# Altium schematic sheet Sheet2.SchDoc
size A3; SheetNumber: 1; SheetTotal: 1
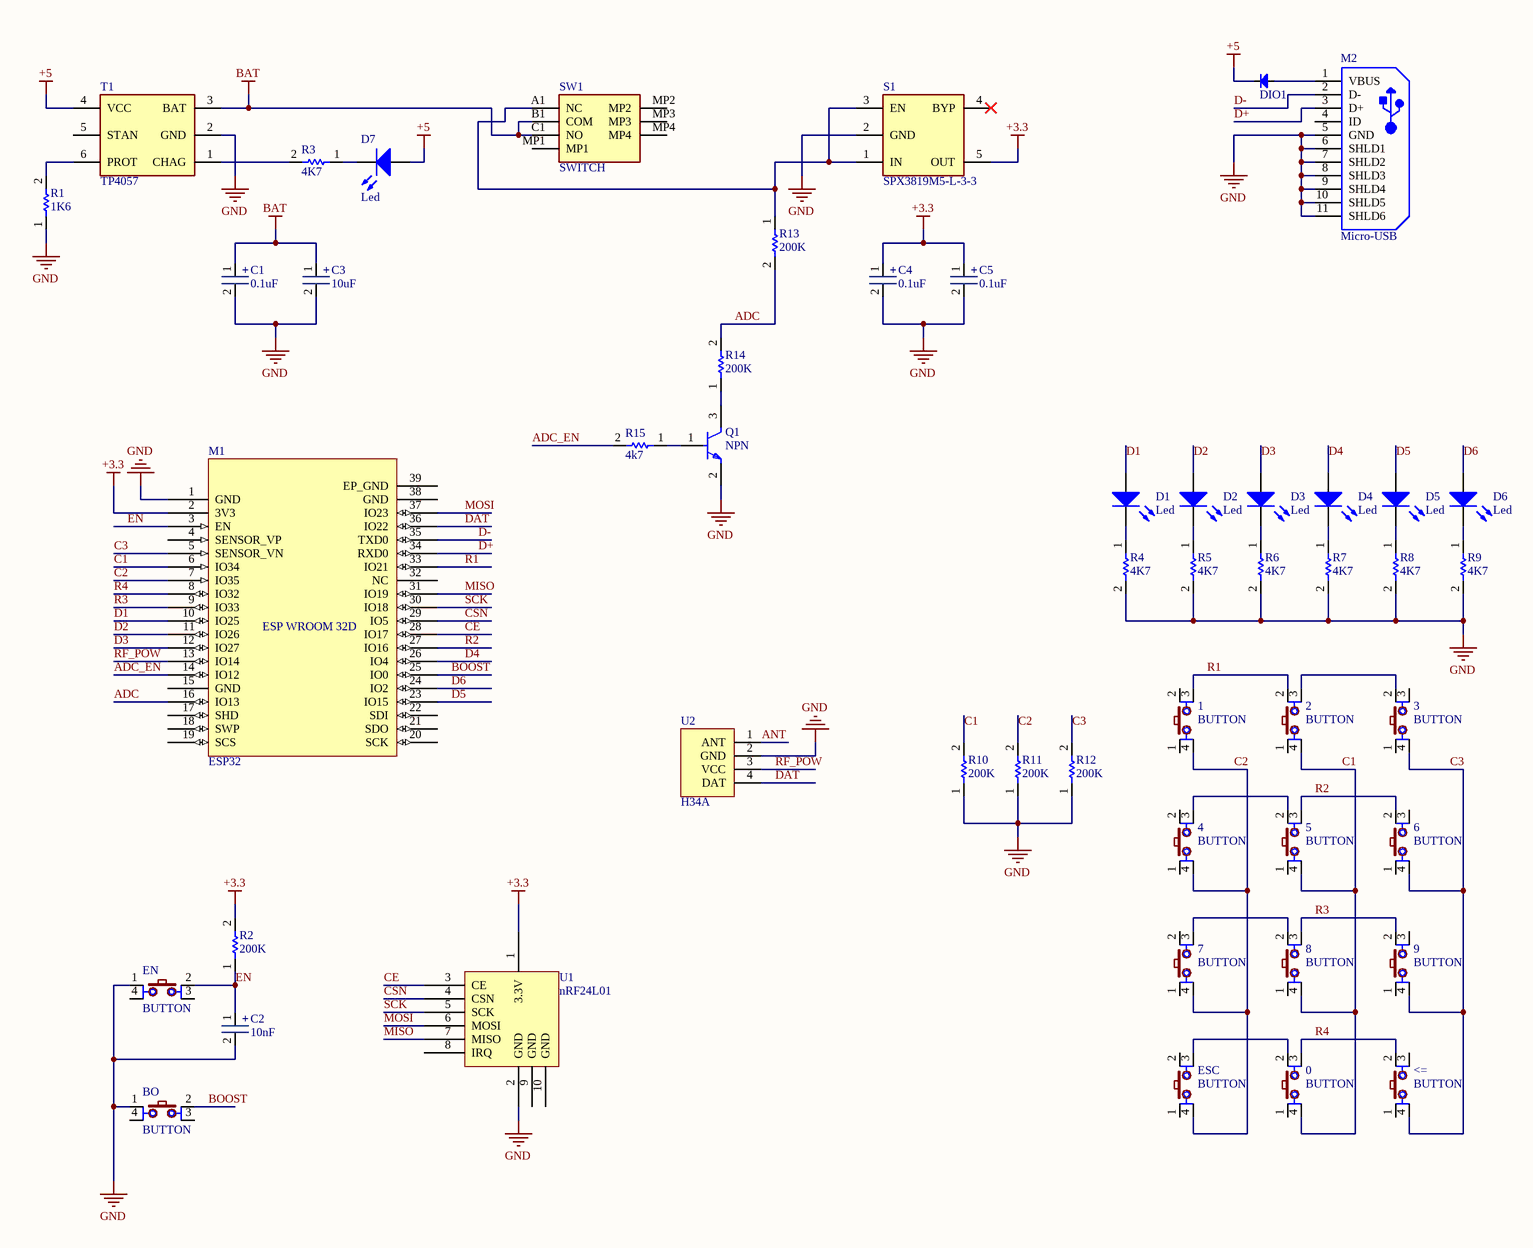
[diagram p0: Sheet2.SchDoc]

## Parts
0  BUTTON  [BUTTON 4X4mm]
1  BUTTON  [BUTTON 4X4mm]
2  BUTTON  [BUTTON 4X4mm]
3  BUTTON  [BUTTON 4X4mm]
4  BUTTON  [BUTTON 4X4mm]
5  BUTTON  [BUTTON 4X4mm]
6  BUTTON  [BUTTON 4X4mm]
7  BUTTON  [BUTTON 4X4mm]
8  BUTTON  [BUTTON 4X4mm]
9  BUTTON  [BUTTON 4X4mm]
<=  BUTTON  [BUTTON 4X4mm]
BO  BUTTON  [BUTTON 3x4mm 4PIN]
C1  0.1uF  [Cap_0603_A]
C2  10nF  [Cap_0603_A]
C3  10uF  [Cap_0603_A]
C4  0.1uF  [Cap_0603_A]
C5  0.1uF  [Cap_0603_A]
D1  Led  [LED 0603]
D2  Led  [LED 0603]
D3  Led  [LED 0603]
D4  Led  [LED 0603]
D5  Led  [LED 0603]
D6  Led  [LED 0603]
D7  Led  [LED 0603]
DIO1  Diode SMD  [DIO-SMD-123]  (value not drawn)
EN  BUTTON  [BUTTON 3x4mm 4PIN]
ESC  BUTTON  [BUTTON 4X4mm]
M1  ESP32  [ESP32-WROOM-32D]
M2  Micro-USB  [2.0 5 PIN SMD]
Q1  NPN  [FP-SOT23-IPC_C]
R1  1K6  [Res_0603]
R2  200K  [Res_0603]
R3  4K7  [Res_0603]
R4  4K7  [Res_0603]
R5  4K7  [Res_0603]
R6  4K7  [Res_0603]
R7  4K7  [Res_0603]
R8  4K7  [Res_0603]
R9  4K7  [Res_0603]
R10  200K  [Res_0603]
R11  200K  [Res_0603]
R12  200K  [Res_0603]
R13  200K  [Res_0603]
R14  200K  [Res_0603]
R15  4k7  [Res_0603]
S1  SPX3819M5-L-3-3  [FP-C04-091-OT-IPC_A]
SW1  SWITCH  [MSK12C02]
T1  TP4057  [TP4057]
U1  nRF24L01  [NRF24L01 + PA SMD]
U2  H34A  [H34A]

## Nets
+3.3: C4.1 C5.1 M1.2(3V3) R2.2 S1.5(OUT) U1.1(3.3V)
+5: D7.1(A) DIO1.2(K) T1.4(VCC)
BAT: C1.1 C3.1 SW1.B1(COM) SW1.C1(NO) T1.3(BAT)
GND: BO.1 C1.2 C2.2 C3.2 C4.2 C5.2 EN.1 M1.1(GND) M2.5(GND) M2.6(SHLD1) M2.7(SHLD2) M2.8(SHLD3) M2.9(SHLD4) M2.10(SHLD5) M2.11(SHLD6) Q1.2(E) R1.1 R4.2 R5.2 R6.2 R7.2 R8.2 R9.2 R10.1 R11.1 R12.1 S1.2(GND) T1.2(GND) U1.2(GND) U2.2(GND)
ADC: M1.16(IO13) R13.2 R14.2
ADC_EN: M1.14(IO12) R15.2
ANT: U2.1(ANT)
BOOST: BO.2 M1.25(IO0)
C1: 0.4 2.4 5.4 8.4 M1.6(IO34) R10.2
C2: 1.4 4.4 7.4 ESC.4 M1.7(IO35) R11.2
C3: 3.4 6.4 9.4 <=.4 M1.5(SENSOR_VN) R12.2
CE: M1.28(IO17) U1.3(CE)
CSN: M1.29(IO5) U1.4(CSN)
D1: D1.1(A) M1.10(IO25)
D2: D2.1(A) M1.11(IO26)
D3: D3.1(A) M1.12(IO27)
D4: D4.1(A) M1.26(IO4)
D5: D5.1(A) M1.23(IO15)
D6: D6.1(A) M1.24(IO2)
D+: M1.34(RXD0) M2.3(D+)
D-: M1.35(TXD0) M2.2(D-)
DAT: M1.36(IO22) U2.4(DAT)
EN: C2.1 EN.2 M1.3(EN) R2.1
MISO: M1.31(IO19) U1.7(MISO)
MOSI: M1.37(IO23) U1.6(MOSI)
R1: 1.3 2.2 M1.33(IO21)
R2: 5.3 6.2 M1.27(IO16)
R3: 8.3 9.2 M1.9(IO33)
R4: 0.3 <=.2 M1.8(IO32)
RF_POW: M1.13(IO14) U2.3(VCC)
SCK: M1.30(IO18) U1.5(SCK)
Net0_2: 0.2 ESC.3
Net2_3: 2.3 3.2
Net4_3: 4.3 5.2
Net7_3: 7.3 8.2
NetD1_2: D1.2(K) R4.1
NetD2_2: D2.2(K) R5.1
NetD3_2: D3.2(K) R6.1
NetD4_2: D4.2(K) R7.1
NetD5_2: D5.2(K) R8.1
NetD6_2: D6.2(K) R9.1
NetD7_2: D7.2(K) R3.1
NetDIO1_1: DIO1.1(A) M2.1(VBUS)
NetQ1_1: Q1.1(B) R15.1
NetQ1_3: Q1.3(C) R14.1
NetR1_2: R1.2 T1.6(PROT)
NetR3_2: R3.2 T1.1(CHAG)
NetR13_1: R13.1 S1.1(IN) S1.3(EN) SW1.A1(NC)

Not connected (* = marked no-connect by the designer): 0 1; 1 1 2; 2 1; 3 1 3; 4 1 2; 5 1; 6 1 3; 7 1 2; 8 1; 9 1 3; <= 1 3; BO 3 4; EN 3 4; ESC 1 2; M1 4(SENSOR_VP) 15(GND) 17(SHD) 18(SWP) 19(SCS) 20(SCK) 21(SDO) 22(SDI) 32(NC) 38(GND) 39(EP_GND); M2 4(ID); S1 4(BYP)*; SW1 MP1 MP2 MP3 MP4; T1 5(STAN); U1 8(IRQ) 9(GND) 10(GND)

## Notes on the sheet
- (in symbol Capacitor) +
- (in symbol ESP32) ESP WROOM 32D

## Library data of the parts
0-9 <= BO EN ESC = BUTTON 4 PIN: Frequency: 100kHz; Low Level Output Current: 200mA; Quiescent Current: 15mA; Min Supply Voltage: 4.5V; Number of Timers/Counters: 1; Max Supply Voltage: 16V; Operating Supply Current: 10mA; High Level Output Current: -200mA; Packaging: Tape and Reel; Weight: 0.002561oz; REACH SVHC: No SVHC; Package Quantity: 2500; Width: 3.91mm; Max Operating Temperature: 70°C; Contact Plating: Gold; Lead Free: Lead Free; Number of Pins: 8; Min Operating Temperature: 0°C; Radiation Hardening: No; Length: 4.9mm; Case/Package: SOIC; Height: 1.58mm; Mount: Surface Mount
C1-C5 = Capacitor: General Purpose Ceramic Capacitor, 0603, 1nF, 10%, X7R, 15%, 50V; Case Code (Metric): 1608; Min Operating Temperature: -55°C; Weight: 7.1E-05oz; Series: -; Capacitance: 1nF; RoHS Compliant: Yes; Radiation Hardening: No; Height: 0.9mm; Mount: Surface Mount; REACH SVHC: No SVHC; Lead Free: Lead Free; Depth: 0.81mm; Voltage: 50V; Number of Pins: 2; Voltage Rating: 50V; Max Operating Temperature: 125°C; Termination: SMD/SMT; Construction: Flat; Case Code (Imperial): 0603; Dielectric: X7R; Width: 0.032inch; Tolerance: 10%; Case/Package: 0603; Contact Plating: Tin; Packaging: Tape and Reel; Voltage Rating (DC): 50V; Dielectric Material: Ceramic; Package Quantity: 4000; Thickness: 0.035inch; Length: 1.6mm
DIO1 = Diode SMD: Default Diode; Code - JEDEC: DO-214-AB; Value: 1N5007; Published: 8-Jun-2000; Revision: July-2002: Re-released for DXP Platform.; Publisher: Altium Limited
R1-R15 = Resistor
S1 = SPX3819M5-L-3-3: Regulator 250mA